# EasyEDA schematic SCH_Hackpad_2024-10-25.json
TITLE: Sheet_1; REV: 1.0; Date: 2024-10-24; Sheet: 1/1; Drawn By: azlan777; Company: Your Company
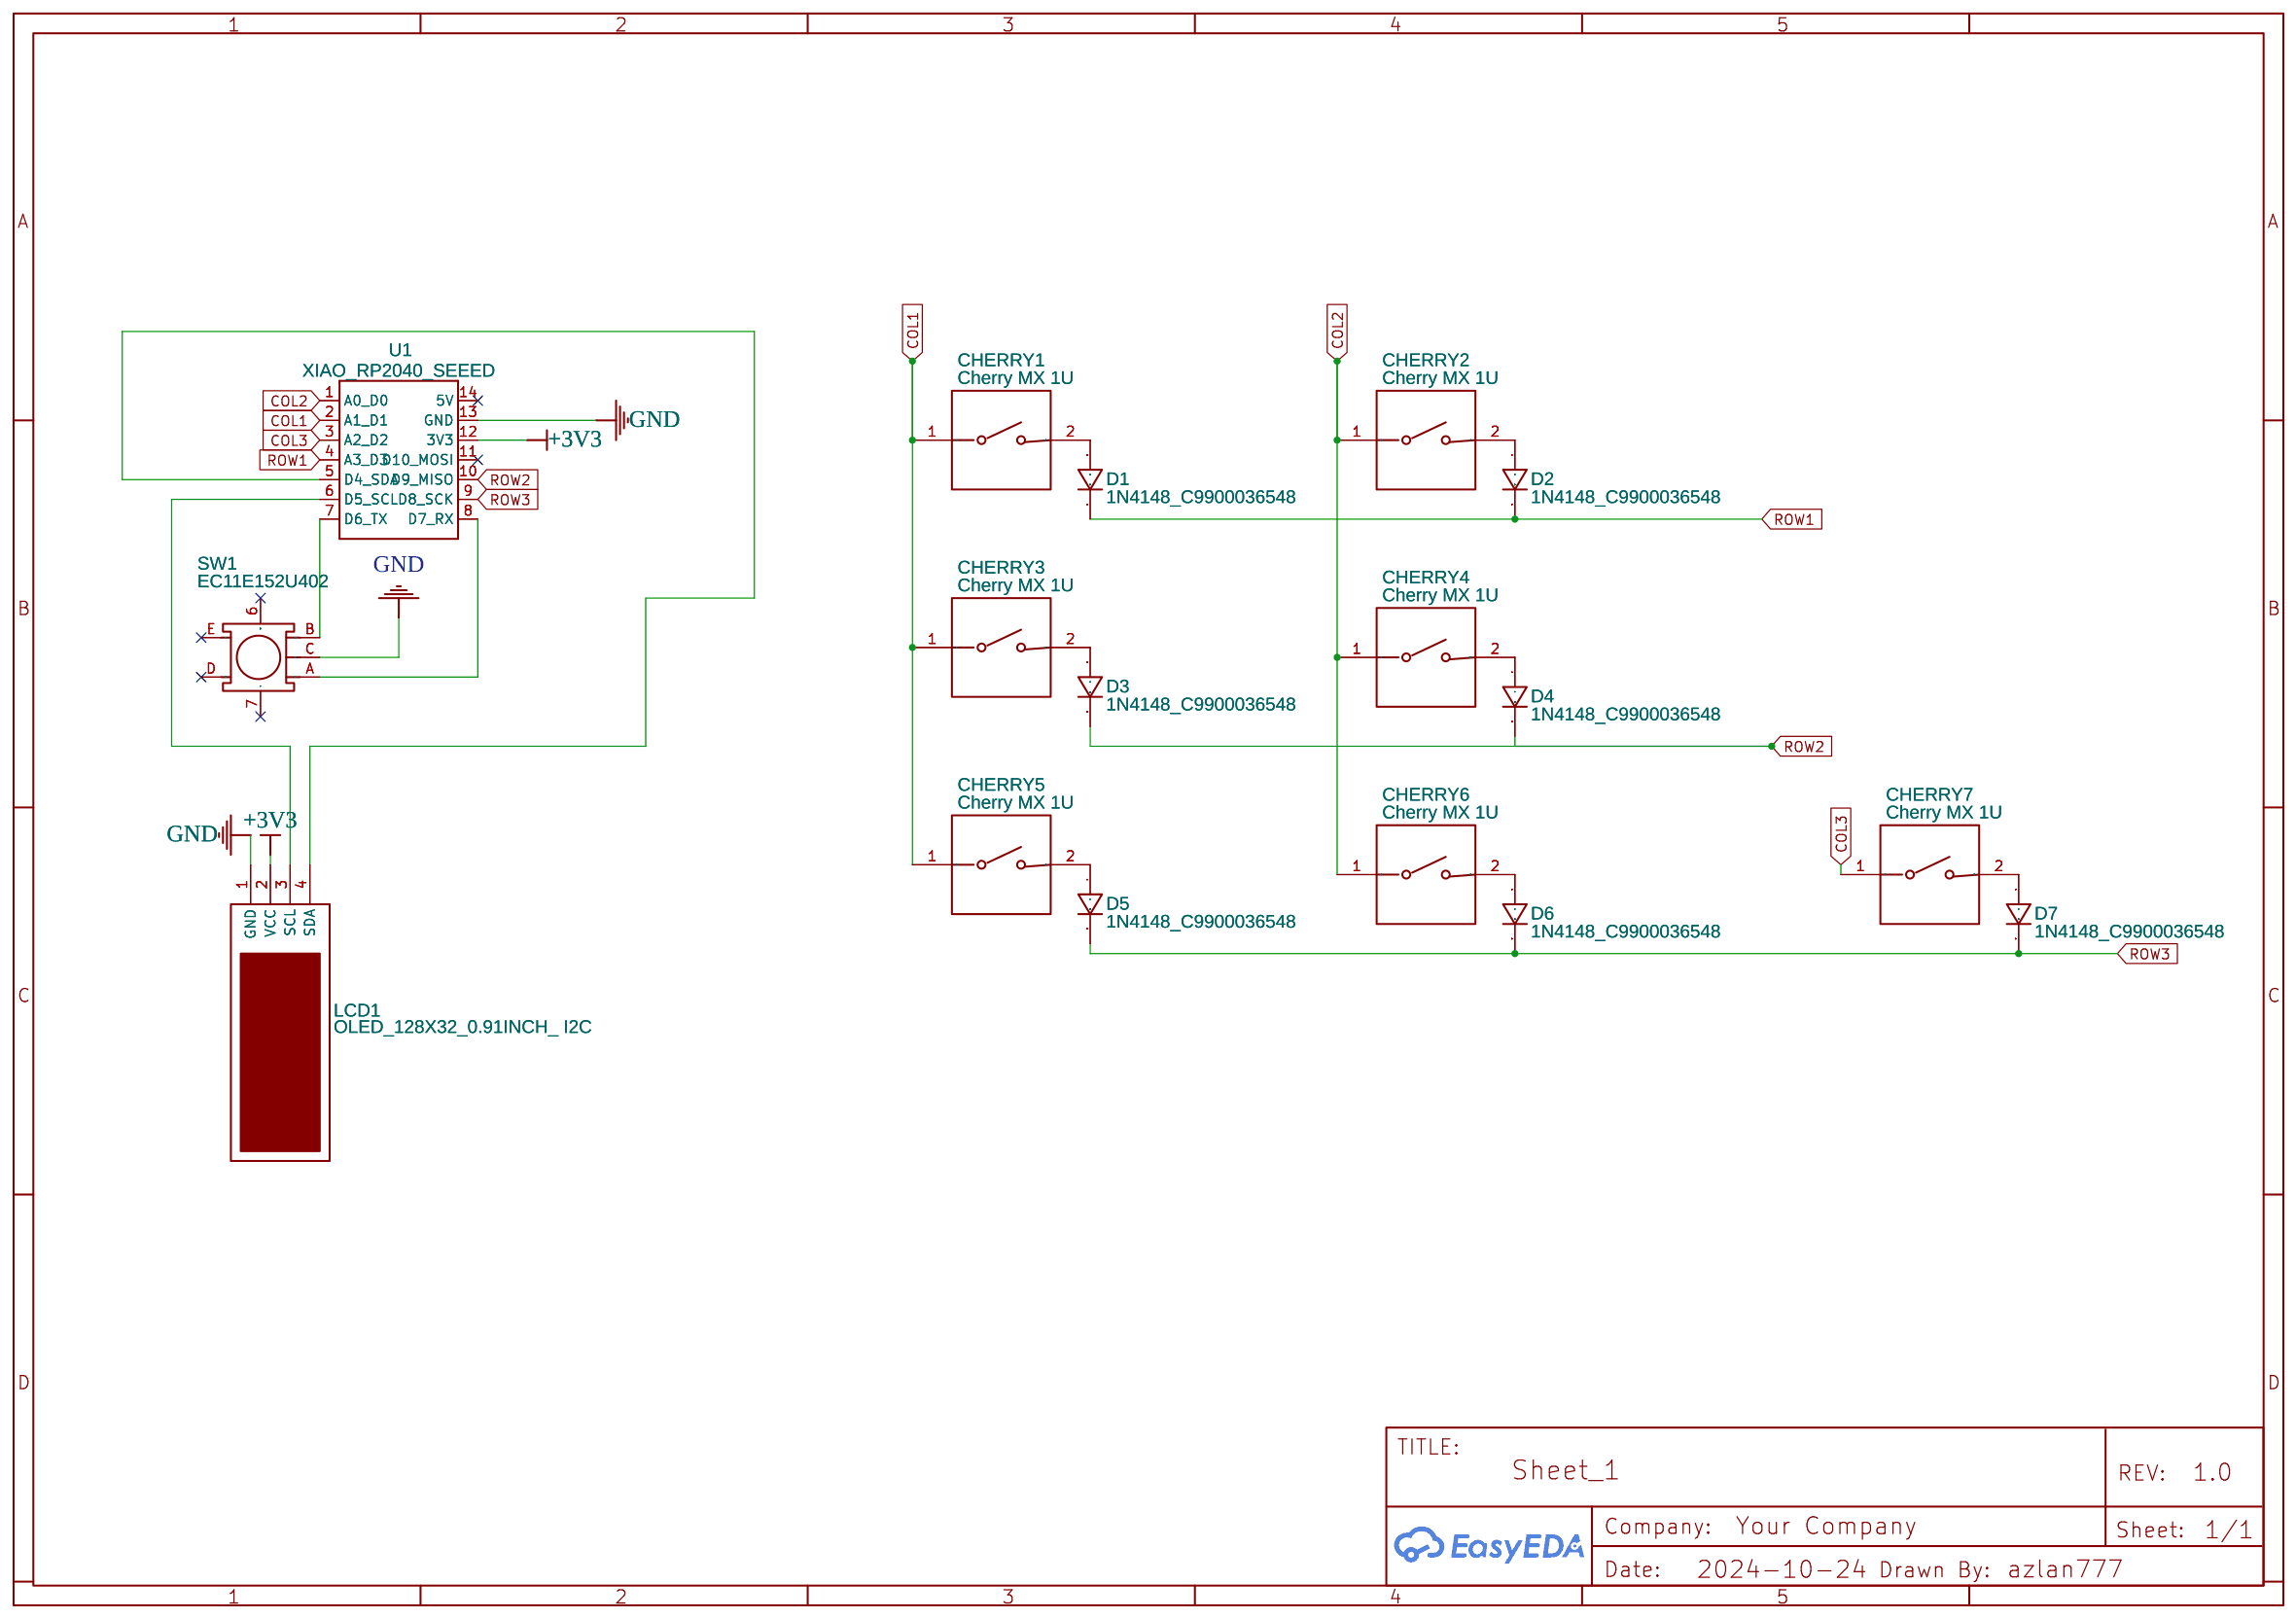
[diagram p0: schematic sheet]

## Parts
CHERRY1  Cherry MX 1U  [CHERRY MX 1U]
CHERRY2  Cherry MX 1U  [CHERRY MX 1U]
CHERRY3  Cherry MX 1U  [CHERRY MX 1U]
CHERRY4  Cherry MX 1U  [CHERRY MX 1U]
CHERRY5  Cherry MX 1U  [CHERRY MX 1U]
CHERRY6  Cherry MX 1U  [CHERRY MX 1U]
CHERRY7  Cherry MX 1U  [CHERRY MX 1U]
D1  1N4148_C9900036548  [DO-35_BD2.2-L4.0-D0.50_1N4148]
D2  1N4148_C9900036548  [DO-35_BD2.2-L4.0-D0.50_1N4148]
D3  1N4148_C9900036548  [DO-35_BD2.2-L4.0-D0.50_1N4148]
D4  1N4148_C9900036548  [DO-35_BD2.2-L4.0-D0.50_1N4148]
D5  1N4148_C9900036548  [DO-35_BD2.2-L4.0-D0.50_1N4148]
D6  1N4148_C9900036548  [DO-35_BD2.2-L4.0-D0.50_1N4148]
D7  1N4148_C9900036548  [DO-35_BD2.2-L4.0-D0.50_1N4148]
LCD1  OLED_128X32_0.91INCH_ I2C  [OLED_128X32_0.91INCH_ I2C]
SW1  EC11E152U402  [SW-TH_EC11XXXXXXXX]
U1  XIAO_RP2040_SEEED  [XIAO_RP2040_SEEED]

## Library data of the parts
CHERRY1-CHERRY7 = Cherry MX 1U: Contributor: info15
D1-D7 = 1N4148_C9900036548: Supplier: LCSC; Supplier Part: C9900036548; Manufacturer: null; Manufacturer Part: 1N4148; JLCPCB Part Class: Extended Part; Contributor: lcsc
LCD1 = OLED_128X32_0.91INCH_ I2C: Contributor: paul.j.lilly
SW1 = EC11E152U402: Contributor: LCSC; Supplier: LCSC; Supplier Part: C110313; Manufacturer: ALPSALPINE(阿尔卑斯阿尔派); JLCPCB Part Class: Extended Part
U1 = XIAO_RP2040_SEEED: Contributor: jeen

## Nets
+3V3: LCD1.2(VCC) U1.12(3V3)
GND: LCD1.1(GND) SW1.C U1.13(GND)
COL1: CHERRY1.1 CHERRY3.1 CHERRY5.1 U1.2(A1_D1)
COL2: CHERRY2.1 CHERRY4.1 CHERRY6.1 U1.1(A0_D0)
COL3: CHERRY7.1 U1.3(A2_D2)
ROW1: D1.2(C) D2.2(C) U1.4(A3_D3)
ROW2: D3.2(C) D4.2(C) U1.10(D9_MISO)
ROW3: D5.2(C) D6.2(C) D7.2(C) U1.9(D8_SCK)
Net-(CHERRY1-2): CHERRY1.2 D1.1(A)
Net-(CHERRY2-2): CHERRY2.2 D2.1(A)
Net-(CHERRY3-2): CHERRY3.2 D3.1(A)
Net-(CHERRY4-2): CHERRY4.2 D4.1(A)
Net-(CHERRY5-2): CHERRY5.2 D5.1(A)
Net-(CHERRY6-2): CHERRY6.2 D6.1(A)
Net-(CHERRY7-2): CHERRY7.2 D7.1(A)
Net-(LCD1-3): LCD1.3(SCL) U1.6(D5_SCL)
Net-(LCD1-4): LCD1.4(SDA) U1.5(D4_SDA)
Net-(SW1-A): SW1.A U1.8(D7_RX)
Net-(SW1-B): SW1.B U1.7(D6_TX)

Not connected (* = marked no-connect by the designer): SW1 6* 7* D* E*; U1 11(D10_MOSI)* 14(5V)*
